# EasyEDA Pro project 步进电机天空星转接板.eprj, schematic Schematic1
Board Name: Board1; Create Date: 2025-07-24; Page Name: P1; Project Name: 步进电机天空星转接板; Schematic Name: Schematic1; Update Date: 2025-07-24; Company: 嘉立创EDA; Page Size: A4; Version: V1.0
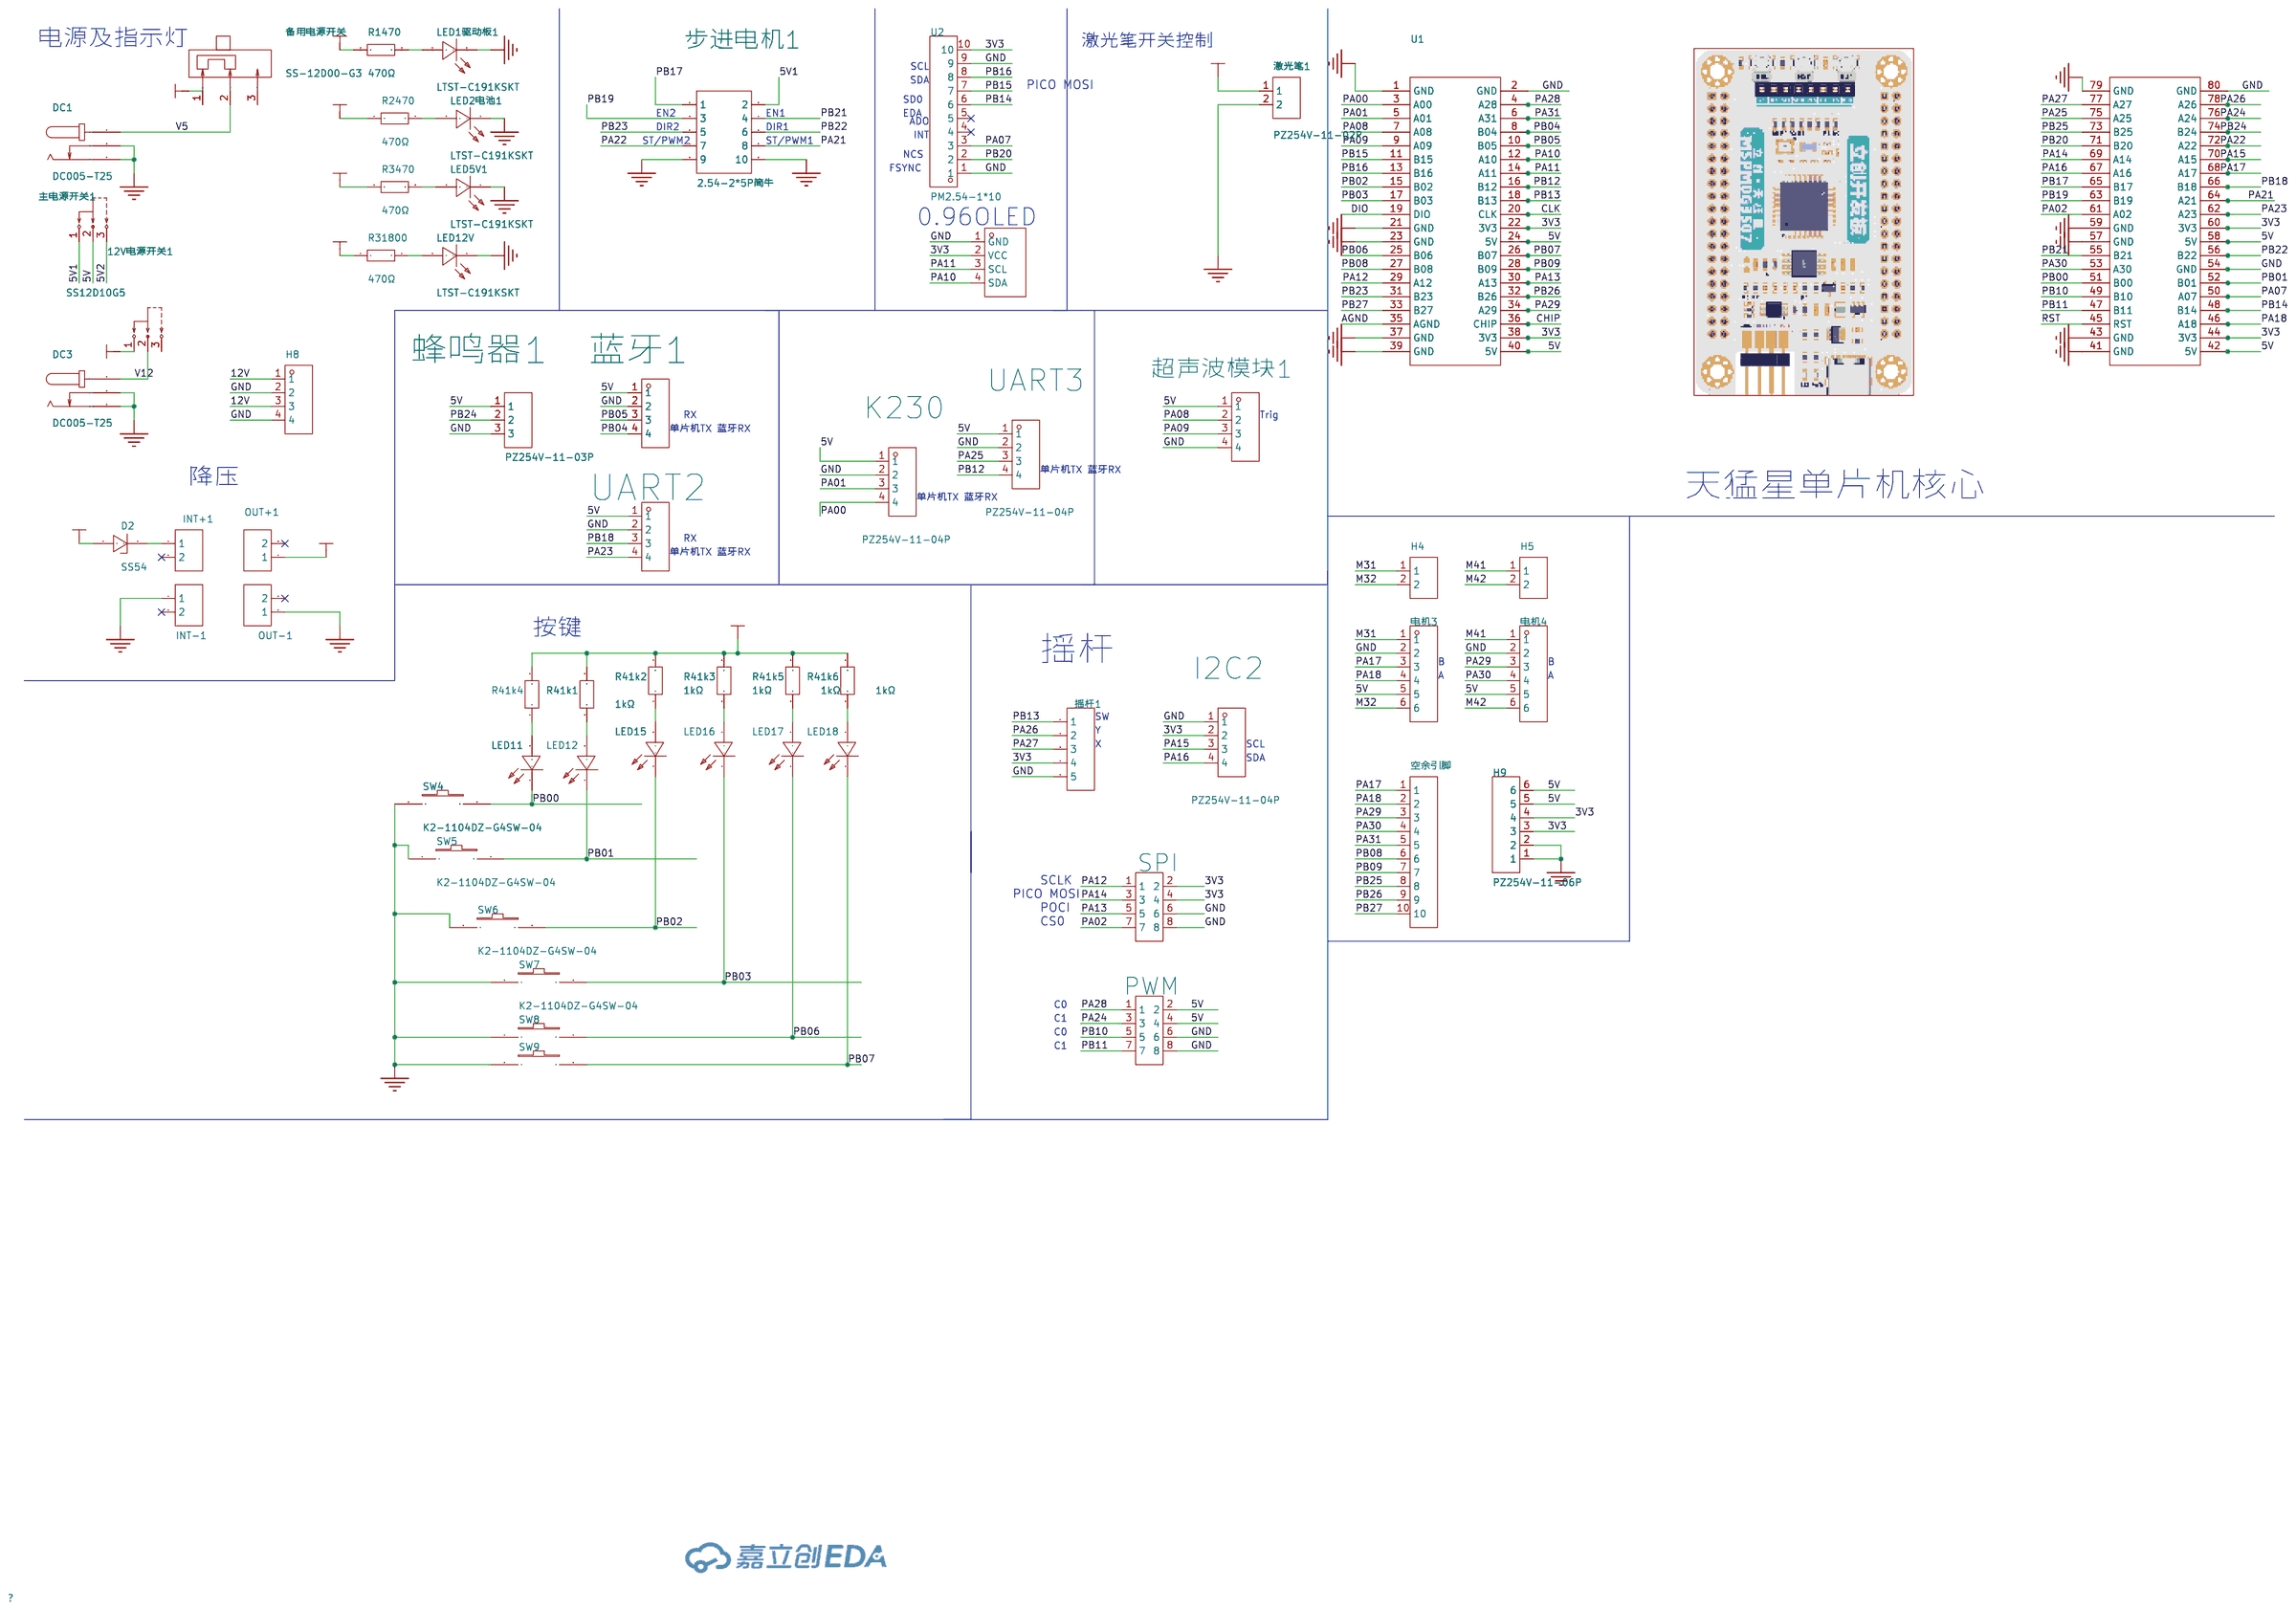
[diagram p0: schematic sheet]

## Parts
12V电源开关1  SS12D10G5  [SW-TH_SHOU-HAN_SS12D10G4]
D2  SS54  [SMA_L4.3-W2.6-LS5.0-FD]
DC1  DC005-T25  [DC-IN-TH_DC-005-20A-1]
DC3  DC005-T25  [DC-IN-TH_DC-005-20A-1]
H4  PZ254V-11-02P  [HDR-TH_2P-P2.54-V-M]
H5  PZ254V-11-02P  [HDR-TH_2P-P2.54-V-M]
H8  PZ254V-11-04P  [HDR-TH_4P-P2.54-V-M]
H9  PZ254V-11-06P  [HDR-TH_6P-P2.54-V-M]
I2C2  PZ254V-11-04P  [HDR-TH_4P-P2.54-V-M]
INT+1  2.54-1*2P母  [HDR-TH_2P-P2.54-V-F]
INT-1  2.54-1*2P母  [HDR-TH_2P-P2.54-V-F]
K230  PZ254V-11-04P  [HDR-TH_4P-P2.54-V-M]
LED1驱动板1  LTST-C191KSKT  [LED0603-RD-YELLOW]
LED2电池1  LTST-C191KSKT  [LED0603-RD-YELLOW]
LED5V1  LTST-C191KSKT  [LED0603-RD-YELLOW]
LED11  LTST-C191KSKT  [LED0603-RD-YELLOW]
LED12  LTST-C191KSKT  [LED0603-RD-YELLOW]
LED12V  LTST-C191KSKT  [LED0603-RD-YELLOW]
LED15  LTST-C191KSKT  [LED0603-RD-YELLOW]
LED16  LTST-C191KSKT  [LED0603-RD-YELLOW]
LED17  LTST-C191KSKT  [LED0603-RD-YELLOW]
LED18  LTST-C191KSKT  [LED0603-RD-YELLOW]
OLED1  HS96L03W2C03  [OLED-TH_L27.8-W27.2-P2.54_C9900033791]
OUT+1  2.54-1*2P母  [HDR-TH_2P-P2.54-V-F]
OUT-1  2.54-1*2P母  [HDR-TH_2P-P2.54-V-F]
PWM  PWM  [HDR-TH_8P-P2.54-V-M-R2-C4-S2.54]
R41k1  1kΩ  [R0603]
R41k2  1kΩ  [R0603]
R41k3  1kΩ  [R0603]
R41k4  1kΩ  [R0603]
R41k5  1kΩ  [R0603]
R41k6  1kΩ  [R0603]
R1470  470Ω  [R0603]
R2470  470Ω  [R0603]
R3470  470Ω  [R0603]
R31800  470Ω  [R0603]
SPI  PZ254V-12-8P  [HDR-TH_8P-P2.54-V-M-R2-C4-S2.54]
SW4  K2-1104DZ-G4SW-04  [KEY-TH_2P-L6.0-W6.0-P5.00]
SW5  K2-1104DZ-G4SW-04  [KEY-TH_2P-L6.0-W6.0-P5.00]
SW6  K2-1104DZ-G4SW-04  [KEY-TH_2P-L6.0-W6.0-P5.00]
SW7  K2-1104DZ-G4SW-04  [KEY-TH_2P-L6.0-W6.0-P5.00]
SW8  K2-1104DZ-G4SW-04  [KEY-TH_2P-L6.0-W6.0-P5.00]
SW9  K2-1104DZ-G4SW-04  [KEY-TH_2P-L6.0-W6.0-P5.00]
U1  LCKFB-TMX-MSPM0G3507  [COMM-TH_LCKFB-TMX-MSPM0G3507]
U2  PM2.54-1*10  [HDR-TH_10P-P2.54-V-F]
UART2  2.54-1*4P母  [HDR-TH_4P-P2.54-V-F]
UART3  PZ254V-11-04P  [HDR-TH_4P-P2.54-V-M]
主电源开关1  SS12D10G5  [SW-TH_SHOU-HAN_SS12D10G4]
备用电源开关  SS-12D00-G3  [SW-TH_3P-L8.8-W3.9-P2.50_SS12D00G3]
摇杆1  2.54-1*5P母  [HDR-TH_5P-P2.54-V-F]
步进电机1  2.54-2*5P简牛  [IDC-TH_10P-P2.54_C5665]
激光笔1  PZ254V-11-02P  [HDR-TH_2P-P2.54-V-M]
电机3  XH-6AW  [CONN-TH_6P-P2.54_HCTL_XH-6AW_C2908615]
电机4  XH-6AW  [CONN-TH_6P-P2.54_HCTL_XH-6AW_C2908615]
空余引脚  空余引脚  [HDR-TH_10P-P2.54-V-M]
蓝牙1  2.54-1*4P母  [HDR-TH_4P-P2.54-V-F]
蜂鸣器1  PZ254V-11-03P  [HDR-TH_3P-P2.54-V-M]
超声波模块1  KH-2.54FH-1X4P-H8.5  [HDR-TH_4P-P2.54-V-F]

## Library data of the parts
12V电源开关1 主电源开关1 = SS12D10G5: 电路结构:单刀双掷;安装方式:直插;额定电流(DC):2A;额定电压(DC):125V;机械寿命:3千次;; LCSC Part Name: 两档立式插件 3脚拨动开关 柄长5.0mm; Supplier Part: C7431054; Manufacturer: SHOU HAN(首韩); Supplier Footprint: 插件; JLCPCB Part Class: 扩展库; Datasheet: https://atta.szlcsc.com/upload/public/pdf/source/20231130/7A3DB6A149BF0A1DCFFE64FFC07FE434.pdf; Supplier: LCSC; Circuit: 单刀双掷; Switch Length: 12.7mm; Switch Width: 6.7mm; Mounting Style: 直插; Current Rating (DC): 2A; Voltage Rating (DC): 125V; Mechanical Life: 3千次; Operating Temperature: -25℃~+70℃
D2 = SS54_C7420369: 二极管配置:独立式;正向压降(Vf):550mV@5.0A;直流反向耐压(Vr):40V;整流电流:5A;; LCSC Part Name: 电压:40V 电流:5A; Supplier Part: C7420369; Manufacturer: 宏迦橙; Supplier Footprint: SMA(DO-214AC); JLCPCB Part Class: 扩展库; Datasheet: https://atta.szlcsc.com/upload/public/pdf/source/20230828/254C3882F8647358AD9F60DD73611B5E.pdf; Supplier: LCSC; Diode Configuration: 独立式; Forward Voltage (Vf@If): 550mV@5.0A; Reverse Voltage (Vr): 40V; Rectified Current: 5A; Reverse Leakage Current (Ir): 50uA@40V
DC1 DC3 = DC005-T25: 触点内径:2.5mm;触点外径:6.3mm;额定电流:-;额定电压:-;; LCSC Part Name: 内径:2.5mm 外径:6.3mm; Supplier Part: C111573; Manufacturer: SOFNG(硕方); Supplier Footprint: 插件; JLCPCB Part Class: 扩展库; Datasheet: https://atta.szlcsc.com/upload/public/pdf/source/20211217/AAF92010038535095742900872F779AE.pdf; Supplier: LCSC; Inside Contact Diameter: 2.5mm; Outside Contact Diameter: 6.3mm
H4 H5 激光笔1 = PZ254V-11-02P: 插针结构:1x2P;间距:2.54mm;行距:-;圆针/方针:方针;安装方式:直插;排数:单排;总PIN位数:2P;额定电流:-;额定电压:-;配合针长度:6mm;塑高:2.5mm;端接针长度:3mm;触头材质:黄铜;触头镀层:-;工作温度:-40℃~+105℃;颜色:黑色;; LCSC Part Name: 1x2P 间距:2.54mm 方针 直插; Supplier Part: C492401; Manufacturer: XFCN(兴飞); Supplier Footprint: 插件,P=2.54mm; JLCPCB Part Class: 扩展库; Datasheet: https://atta.szlcsc.com/upload/public/pdf/source/20200309/C492401_A812433581A9B211A7FFA413ADDFF0E5.pdf; Supplier: LCSC; Pin Structure: 1x2P; Pitch: 2.54mm; Circluar Pins/Square Pins: 方针; Mounting Type: 直插; Number of Rows: 单排; Number of Pins: 2P; Length of Mating Pin: 6mm; Insulation Height: 2.5mm; Length of End Connection Pin: 3mm; Contact Material: 黄铜; Operating Temperature: -40℃~+105℃; Color: 黑色
H8 I2C2 K230 UART3 = PZ254V-11-04P: 插针结构:1x4P;间距:2.54mm;行距:-;圆针/方针:方针;安装类型:直插;排数:单排;总PIN位数:4P;额定电流:3A;额定电压:250V;配合针长度:6mm;塑高:2.5mm;端接针长度:3mm;触头材质:-;工作温度范围:-40℃~+105℃;颜色:黑色;; LCSC Part Name: 间距:2.54mm 1x4P 直插 方针; Supplier Part: C2691448; Manufacturer: XFCN(兴飞); Supplier Footprint: 插件,P=2.54mm; JLCPCB Part Class: 扩展库; Datasheet: https://atta.szlcsc.com/upload/public/pdf/source/20200309/C492403_F9F19131791D08044AD4F84F8E751A34.pdf; Supplier: LCSC; Pin Structure: 1x4P; Pitch: 2.54mm; Circluar Pins/Square Pins: 方针; Mounting Type: 直插; Number of Rows: 单排; Number of Pins: 4P; Current Rating (Max): 3A; Voltage Rating (Max): 250V; Length of Mating Pin: 6mm; Insulation Height: 2.5mm; Length of End Connection Pin: 3mm; Operating Temperature Range: -40℃~+105℃; Color: 黑色
H9 = PZ254V-11-06P: 插针结构:1x6P;间距:2.54mm;行距:-;圆针/方针:方针;安装方式:直插;排数:单排;总PIN位数:6P;额定电流:-;额定电压:-;配合针长度:6mm;塑高:2.5mm;端接针长度:3mm;触头材质:黄铜;触头镀层:-;工作温度:-40℃~+105℃;颜色:黑色;; LCSC Part Name: 1x6P 间距:2.54mm 方针 直插; Supplier Part: C492405; Manufacturer: XFCN(兴飞); Supplier Footprint: 插件,P=2.54mm; JLCPCB Part Class: 扩展库; Datasheet: https://atta.szlcsc.com/upload/public/pdf/source/20200309/C492405_597F1930F5B55CC3C7FD95458F1C3977.pdf; Supplier: LCSC; Pin Structure: 1x6P; Pitch: 2.54mm; Circluar Pins/Square Pins: 方针; Mounting Type: 直插; Number of Rows: 单排; Number of Pins: 6P; Length of Mating Pin: 6mm; Insulation Height: 2.5mm; Length of End Connection Pin: 3mm; Contact Material: 黄铜; Operating Temperature: -40℃~+105℃; Color: 黑色
INT+1 INT-1 OUT+1 OUT-1 = 2.54-1*2P母: 插孔结构:1x2P;间距:2.54mm;行距:-;安装类型:直插;排数:单排;总孔位数:2P;塑高:-;触头材质:-;触头镀层:-;; LCSC Part Name: 间距:2.54mm 1x2P 直插; Supplier Part: C49661; Manufacturer: BOOMELE(博穆精密); Supplier Footprint: 插件,P=2.54mm; JLCPCB Part Class: 扩展库; Datasheet: https://atta.szlcsc.com/upload/public/pdf/source/20210301/C2718488_F4427B881E42CAA8DDB0B1C12B3A522C.pdf; Supplier: LCSC; Holes Structure: 1x2P; Pitch: 2.54mm; Mounting Type: 直插; Number of Rows: 单排; Number of Holes: 2P
LED1驱动板1 LED2电池1 LED5V1 LED11 LED12 LED12V LED15-LED18 = LTST-C191KSKT: 发光颜色:黄色;正向电压(VF):2.1V;功率:75mW;正向电流:20mA;主波长:584.5nm~597nm;二极管配置:-;透镜颜色:无色透明透镜;色温:-;发光强度:104mcd;发光角度:130°;载带方式:-;工作温度:-55℃~+85℃;; LCSC Part Name: 黄灯; Supplier Part: C125100; Manufacturer: LITEON(光宝); Supplier Footprint: 0603; JLCPCB Part Class: 扩展库; Datasheet: https://atta.szlcsc.com/upload/public/pdf/source/20180129/C125100_15171877314981315871.pdf; Supplier: LCSC; Emitted Color: 黄色; Forward Voltage (VF): 2.1V; Power Dissipation: 75mW; Forward Current: 20mA; Dominant Wavelength: 584.5nm~597nm; Peak Wavelength: 588nm; Lens Color: 无色透明透镜; Luminous Intensity: 104mcd; Viewing Angle: 130°; Operating Temperature: -55℃~+85℃
OLED1 = HS96L03W2C03: 主控芯片:SSD1315;接口类型:I2C;尺寸(inch):0.96;像素分辨率:128x64;; LCSC Part Name: 0.96寸OLED显示屏窄白光IIC; Supplier Part: C5248080; Manufacturer: HS(汉昇); JLCPCB Part Class: 扩展库; Datasheet: https://atta.szlcsc.com/upload/public/pdf/source/20230627/763D01F79A90007632F098068C7C8AD9.pdf; Supplier: LCSC; Main Control Chip: SSD1315; Interface Type: I2C; Size: 0.96; Pixel Resolution: 128x64; Operating Temperature: -40℃~+70℃
PWM SPI = PZ254V-12-8P: 插针结构:2x4P;间距:2.54mm;行距:2.54mm;圆针/方针:方针;安装方式:直插;排数:双排;总PIN位数:8P;额定电流:-;额定电压:-;配合针长度:6mm;塑高:2.5mm;端接针长度:3mm;触头材质:黄铜;触头镀层:-;工作温度:-40℃~+105℃;颜色:黑色;; LCSC Part Name: 2x4P 间距:2.54mm 方针 直插; Supplier Part: C492421; Manufacturer: XFCN(兴飞); Supplier Footprint: 插件,P=2.54mm; JLCPCB Part Class: 扩展库; Datasheet: https://atta.szlcsc.com/upload/public/pdf/source/20200309/C492421_DC8A206AF99CD7755BD4A5B0BC48200B.pdf; Supplier: LCSC; Pin Structure: 2x4P; Pitch: 2.54mm; Row Spacing: 2.54mm; Circluar Pins/Square Pins: 方针; Mounting Type: 直插; Number of Rows: 双排; Number of Pins: 8P; Length of Mating Pin: 6mm; Insulation Height: 2.5mm; Length of End Connection Pin: 3mm; Contact Material: 黄铜; Operating Temperature: -40℃~+105℃; Color: 黑色
R41k1-R41k6 = FCR0603F1K: 电阻类型:厚膜电阻;阻值:1kΩ;精度:±1%;功率:100mW;最大工作电压:75V;; LCSC Part Name: 1K ±1%; Supplier Part: C5913168; Manufacturer: VO(翔胜); Supplier Footprint: 0603; JLCPCB Part Class: 扩展库; Datasheet: https://atta.szlcsc.com/upload/public/pdf/source/20230428/98B65D379E9BA4CF2A9223D1647B01B6.pdf; Supplier: LCSC; Type: 厚膜电阻; Tolerance: ±1%; Power(Watts): 100mW; Overload Voltage (Max): 75V; Operating Temperature Range: -55℃~+155℃
R1470 R2470 R3470 R31800 = 0603WAF4700T5E: 电阻类型:厚膜电阻;阻值:470Ω;精度:±1%;功率:100mW;最大工作电压:75V;温度系数:±100ppm/℃;; LCSC Part Name: 470Ω ±1% 100mW 厚膜电阻; Supplier Part: C23179; Manufacturer: UNI-ROYAL(厚声); Supplier Footprint: 0603; JLCPCB Part Class: 基础库; Datasheet: https://atta.szlcsc.com/upload/public/pdf/source/20200306/C422600_1E6D84923E4A46A82E41ADD87F860B5C.pdf; Supplier: LCSC; Type: 厚膜电阻; Tolerance: ±1%; Power(Watts): 100mW; Overload Voltage (Max): 75V; Temperature Coefficient: ±100ppm/℃; Operating Temperature Range: -55℃~+155℃
SW4-SW9 = K2-1104DZ-G4SW-04: 作用力:250gf;安装方式:直插;开关长度:6mm;开关宽度:6mm;开关高度:7mm;触点电流:50mA;额定电压(DC):12V;绝缘电阻:100MΩ;机械寿命:10万次;; LCSC Part Name: 6*6*7 两脚长脚开关; Supplier Part: C961736; Manufacturer: 韩国韩荣; Supplier Footprint: 插件; JLCPCB Part Class: 扩展库; Datasheet: https://atta.szlcsc.com/upload/public/pdf/source/20201126/C961736_4F85C6E6E5B3656D5DC7C0B00D034F4A.pdf; Supplier: LCSC; Operating Force: 250gf; Mounting Style: 直插; Switch Length: 6mm; Switch Width: 6mm; Switch Height: 7mm; Contact Current: 50mA; Voltage Rating (DC): 12V; Insulation Resistance: 100MΩ; Mechanical Life: 10万次; Operating Temperature: -25℃~+85℃
U1 = LCKFB-TMX-MSPM0G3507: LCSC Part Name: 5件套 立创·天猛星MSPM0G3507开发板; Supplier Part: C42378531; Manufacturer: 立创开发板; Datasheet: https://atta.szlcsc.com/upload/public/pdf/source/20241209/800332349277522348D9357AB5109808.pdf; Supplier: LCSC
U2 = PM2.54-1*10: LCSC Part Name: 间距:2.54mm 1x10P 直插; Supplier Part: C5116489; Manufacturer: ZHOURI(洲日); Supplier Footprint: 插件,P=2.54mm; JLCPCB Part Class: 扩展库; Datasheet: https://atta.szlcsc.com/upload/public/pdf/source/20220803/0A90D5F6AD0A236C4C7DDEE7A7CA5EA3.pdf; Supplier: LCSC; Holes Structure: 1x10P; Pitch: 2.54mm; Row Spacing: 2.54mm; Circular Hole / Square Hole: 方孔; Mounting Type: 直插; Number of Rows: 单排; Number of Holes: 10P; Current Rating (Max): 2.5A; Holes Direction: 顶部; Insulation Height: 8.5mm; Operating Temperature Range: -40℃~+105℃
UART2 蓝牙1 = 2.54-1*4P母: 插孔结构:1x4P;间距:2.54mm;行距:-;圆孔/方孔:方孔;安装类型:直插;排数:单排;总孔位数:4P;额定电流:3A;额定电压:-;插孔方向:顶部;塑高:-;触头材质:青铜;触头镀层:-;工作温度范围:-40℃~+105℃;焊接温度(最大值):-;; LCSC Part Name: 间距:2.54mm 1x4P 直插; Supplier Part: C2718488; Manufacturer: BOOMELE(博穆精密); Supplier Footprint: 插件,P=2.54mm; JLCPCB Part Class: 扩展库; Datasheet: https://atta.szlcsc.com/upload/public/pdf/source/20210301/C2718488_F4427B881E42CAA8DDB0B1C12B3A522C.pdf; Supplier: LCSC; Holes Structure: 1x4P; Pitch: 2.54mm; Circular Hole / Square Hole: 方孔; Mounting Type: 直插; Number of Rows: 单排; Number of Holes: 4P; Current Rating (Max): 3A; Holes Direction: 顶部; Contact Material: 青铜; Operating Temperature Range: -40℃~+105℃
备用电源开关 = SS-12D00-G3: Supplier Part: C22355741; Manufacturer: SOFNG(硕方); Supplier Footprint: 插件-3P,8.8x3.9mm; JLCPCB Part Class: 扩展库; Datasheet: https://atta.szlcsc.com/upload/public/pdf/source/20240529/1037A069FE9BBCECE56007AB916D4384.pdf; Supplier: LCSC
摇杆1 = 2.54-1*5P母: 插孔结构:1x5P;间距:2.54mm;行距:-;安装类型:直插;排数:单排;总孔位数:5P;塑高:-;触头材质:-;触头镀层:-;; LCSC Part Name: 间距:2.54mm 1x5P 直插; Supplier Part: C50950; Manufacturer: BOOMELE(博穆精密); Supplier Footprint: 插件,P=2.54mm; JLCPCB Part Class: 扩展库; Datasheet: https://atta.szlcsc.com/upload/public/pdf/source/20210301/C2718488_F4427B881E42CAA8DDB0B1C12B3A522C.pdf; Supplier: LCSC; Holes Structure: 1x5P; Pitch: 2.54mm; Mounting Type: 直插; Number of Rows: 单排; Number of Holes: 5P
步进电机1 = 2.54-2*5P简牛: 连接器类型:简牛座;间距:2.54mm;结构:2x5P;封装形式:直插;行距:2.54mm;排数:2;每排PIN数:5;触头材质:-;触头镀层:-;; LCSC Part Name: 2.54mm 2x5P 排数:2 每排P数:5; Supplier Part: C5665; Manufacturer: BOOMELE(博穆精密); Supplier Footprint: 插件,P=2.54mm; JLCPCB Part Class: 扩展库; Datasheet: https://atta.szlcsc.com/upload/public/pdf/source/20140331/1457707037896.pdf; Supplier: LCSC; Connector Type: 简牛座; Pitch: 2.54mm; Structure: 2x5P; Holder Type: 直插; Row Spacing: 2.54mm; Number of Rows: 2; Pin Number in each Row: 5
电机3 电机4 = XH-6AW: 插针结构:1x6P;间距:2.5mm;安装方式:弯插;参考系列:XH;总PIN数:6P;排数:1;每排PIN数:6;行距:-;额定电流:3A;触头材质:黄铜;触头镀层:锡;工作温度范围:-25℃~+85℃;; LCSC Part Name: 1x6P 间距:2.5mm 弯插 系列:XH; Supplier Part: C2908615; Manufacturer: HCTL(华灿天禄); Supplier Footprint: 弯插,P=2.5mm; JLCPCB Part Class: 扩展库; Datasheet: https://atta.szlcsc.com/upload/public/pdf/source/20230711/B565BAF3B11666EF6B81B3605408F2BD.pdf; Supplier: LCSC; Pins Structure: 1x6P; Pitch: 2.5mm; Mounting Style: 弯插; Reference Series: XH; Number of Pins: 6P; Number of Rows: 1; Number of PINs Per Row: 6; Current Rating (Max): 3A; Contact Material: 黄铜; Contact Plating: 锡; Operating Temperature Range: -25℃~+85℃
空余引脚 = PZ254V-11-10P: LCSC Part Name: 1x10P 间距:2.54mm 方针 直插; Supplier Part: C492409; Manufacturer: XFCN(兴飞); Supplier Footprint: 插件,P=2.54mm; JLCPCB Part Class: 扩展库; Datasheet: https://atta.szlcsc.com/upload/public/pdf/source/20200309/C492409_129C9431BDD62EBBBD0A643B6AAB9FBD.pdf; Supplier: LCSC; Pin Structure: 1x10P; Pitch: 2.54mm; Circluar Pins/Square Pins: 方针; Mounting Type: 直插; Number of Rows: 单排; Number of Pins: 10P; Length of Mating Pin: 6mm; Insulation Height: 2.5mm; Length of End Connection Pin: 3mm; Contact Material: 黄铜; Operating Temperature: -40℃~+105℃; Color: 黑色
蜂鸣器1 = PZ254V-11-03P: 插针结构:1x3P;间距:2.54mm;行距:-;圆针/方针:方针;安装方式:直插;排数:单排;总PIN位数:3P;额定电流:3A;额定电压:250V;配合针长度:6mm;塑高:2.5mm;端接针长度:3mm;工作温度:-40℃~+105℃;颜色:黑色;; LCSC Part Name: 1x3P 间距:2.54mm 方针 直插; Supplier Part: C2937625; Manufacturer: XFCN(兴飞); Supplier Footprint: 插件,P=2.54mm; JLCPCB Part Class: 扩展库; Datasheet: https://atta.szlcsc.com/upload/public/pdf/source/20200309/C492402_8335C3D49C4E4C618838D59BB1D024C1.pdf; Supplier: LCSC; Pin Structure: 1x3P; Pitch: 2.54mm; Circluar Pins/Square Pins: 方针; Mounting Type: 直插; Number of Rows: 单排; Number of Pins: 3P; Current Rating: 3A; Voltage Rating (Max): 250V; Length of Mating Pin: 6mm; Insulation Height: 2.5mm; Length of End Connection Pin: 3mm; Operating Temperature: -40℃~+105℃; Color: 黑色
超声波模块1 = KH-2.54FH-1X4P-H8.5: 插孔结构:1x4P;间距:2.54mm;行距:-;圆孔/方孔:方孔;安装类型:直插;排数:单排;总孔位数:4P;额定电流:3A;额定电压:-;插孔方向:顶部;塑高:8.5mm;工作温度范围:-40℃~+105℃;; LCSC Part Name: 间距:2.54mm 1x4P 直插; Supplier Part: C2905415; Manufacturer: kinghelm(金航标); Supplier Footprint: 插件,P=2.54mm; JLCPCB Part Class: 扩展库; Datasheet: https://atta.szlcsc.com/upload/public/pdf/source/20211019/F01742C8B89DCA4810A857CC894DA6D1.pdf; Supplier: LCSC; Holes Structure: 1x4P; Pitch: 2.54mm; Circular Hole / Square Hole: 方孔; Mounting Type: 直插; Number of Rows: 单排; Number of Holes: 4P; Current Rating (Max): 3A; Holes Direction: 顶部; Insulation Height: 8.5mm; Operating Temperature Range: -40℃~+105℃

## Nets
3V3: H9.3 H9.4 I2C2.2 OLED1.2(VCC) R41k1.2 R41k2.2 R41k3.2 R41k4.2 R41k5.2 R41k6.2 SPI.2 SPI.4 U1.22(3V3) U1.38(3V3) U1.44(3V3) U1.60(3V3) U2.10 摇杆1.4 激光笔1.1
5V: H9.5 H9.6 K230.1 PWM.2 PWM.4 R3470.1 U1.24(5V) U1.40(5V) U1.42(5V) U1.58(5V) UART2.1 UART3.1 主电源开关1.2 备用电源开关.1 电机3.5 电机4.5 蓝牙1.1 蜂鸣器1.1 超声波模块1.1
5V1: R1470.1 主电源开关1.1 步进电机1.2
5V2: OUT+1.1 主电源开关1.3
12V: 12V电源开关1.1 D2.1(A) H8.1 H8.3 R31800.1
AGND: U1.35(AGND)
GND: DC1.2 DC1.3 DC3.2 DC3.3 H8.2 H8.4 H9.1 H9.2 I2C2.1 INT-1.1 K230.2 LED1驱动板1.1(-) LED2电池1.1(-) LED5V1.1(-) LED12V.1(-) OLED1.1(GND) OUT-1.1 PWM.6 PWM.8 SPI.6 SPI.8 SW4.1 SW5.1 SW6.1 SW7.1 SW8.1 SW9.1 U1.1(GND) U1.2(GND) U1.21(GND) U1.23(GND) U1.37(GND) U1.39(GND) U1.41(GND) U1.43(GND) U1.54(GND) U1.57(GND) U1.59(GND) U1.79(GND) U1.80(GND) U2.1 U2.9 UART2.2 UART3.2 摇杆1.5 步进电机1.9 步进电机1.10 激光笔1.2 电机3.2 电机4.2 蓝牙1.2 蜂鸣器1.3 超声波模块1.4
V5: DC1.1 R2470.1 备用电源开关.2
V12: 12V电源开关1.2 DC3.1
CHIP: U1.36(CHIP)
CLK: U1.20(CLK)
DIO: U1.19(DIO)
M31: H4.1 电机3.1
M32: H4.2 电机3.6
M41: H5.1 电机4.1
M42: H5.2 电机4.6
PA00: K230.4 U1.3(A00)
PA01: K230.3 U1.5(A01)
PA02: SPI.7 U1.61(A02)
PA07: U1.50(A07) U2.3
PA08: U1.7(A08) 超声波模块1.2
PA09: U1.9(A09) 超声波模块1.3
PA10: OLED1.4(SDA) U1.12(A10)
PA11: OLED1.3(SCL) U1.14(A11)
PA12: SPI.1 U1.29(A12)
PA13: SPI.5 U1.30(A13)
PA14: SPI.3 U1.69(A14)
PA15: I2C2.3 U1.70(A15)
PA16: I2C2.4 U1.67(A16)
PA17: U1.68(A17) 电机3.3 空余引脚.1
PA18: U1.46(A18) 电机3.4 空余引脚.2
PA21: U1.64(A21) 步进电机1.8
PA22: U1.72(A22) 步进电机1.7
PA23: U1.62(A23) UART2.4
PA24: PWM.3 U1.76(A24)
PA25: U1.75(A25) UART3.3
PA26: U1.78(A26) 摇杆1.2
PA27: U1.77(A27) 摇杆1.3
PA28: PWM.1 U1.4(A28)
PA29: U1.34(A29) 电机4.3 空余引脚.3
PA30: U1.53(A30) 电机4.4 空余引脚.4
PA31: U1.6(A31) 空余引脚.5
PB00: LED11.1(-) SW4.2 U1.51(B00)
PB01: LED12.1(-) SW5.2 U1.52(B01)
PB02: LED15.1(-) SW6.2 U1.15(B02)
PB03: LED16.1(-) SW7.2 U1.17(B03)
PB04: U1.8(B04) 蓝牙1.4
PB05: U1.10(B05) 蓝牙1.3
PB06: LED17.1(-) SW8.2 U1.25(B06)
PB07: LED18.1(-) SW9.2 U1.26(B07)
PB08: U1.27(B08) 空余引脚.6
PB09: U1.28(B09) 空余引脚.7
PB10: PWM.5 U1.49(B10)
PB11: PWM.7 U1.47(B11)
PB12: U1.16(B12) UART3.4
PB13: U1.18(B13) 摇杆1.1
PB14: U1.48(B14) U2.6
PB15: U1.11(B15) U2.7
PB16: U1.13(B16) U2.8
PB17: U1.65(B17) 步进电机1.1
PB18: U1.66(B18) UART2.3
PB19: U1.63(B19) 步进电机1.3
PB20: U1.71(B20) U2.2
PB21: U1.55(B21) 步进电机1.4
PB22: U1.56(B22) 步进电机1.6
PB23: U1.31(B23) 步进电机1.5
PB24: U1.74(B24) 蜂鸣器1.2
PB25: U1.73(B25) 空余引脚.8
PB26: U1.32(B26) 空余引脚.9
PB27: U1.33(B27) 空余引脚.10
RST: U1.45(RST)
$1N2098: LED1驱动板1.2(+) R1470.2
$1N2102: LED5V1.2(+) R3470.2
$1N3077: LED12V.2(+) R31800.2
$1N6588: LED11.2(+) R41k4.1
$1N6591: LED12.2(+) R41k1.1
$1N6592: LED15.2(+) R41k2.1
$1N6593: LED16.2(+) R41k3.1
$1N6603: LED17.2(+) R41k5.1
$1N6604: LED18.2(+) R41k6.1
$1N7225: D2.2(K) INT+1.1
Net-(LED2电池1-2): LED2电池1.2(+) R2470.2

Not connected (* = marked no-connect by the designer): 12V电源开关1 3; INT+1 2*; INT-1 2*; OUT+1 2*; OUT-1 2*; U2 4* 5*; 备用电源开关 3

## Notes on the sheet
- 电源及指示灯
- SCL
- 激光笔开关控制
- SDA
- PICO MOSI
- SD0
- EN2
- EN1
- EDA
- ADO
- ST/PWM2
- DIR2
- DIR1
- ST/PWM1
- INT
- NCS
- FSYNC
- 0.96OLED
- RX
- Trig
- 单片机TX 蓝牙RX
- 单片机TX 蓝牙RX
- 降压
- 单片机TX 蓝牙RX
- 天猛星单片机核心
- RX
- 单片机TX 蓝牙RX
- 按键
- 摇杆
- A
- B
- A
- B
- SW
- Y
- X
- SCL
- SDA
- SCLK
- PICO MOSI
- POCI
- CS0
- C0
- C1
- C0
- C1
